# Altium schematic sheet MPU-6050.SchDoc
size A4; SheetNumber: 3; SheetTotal: 4
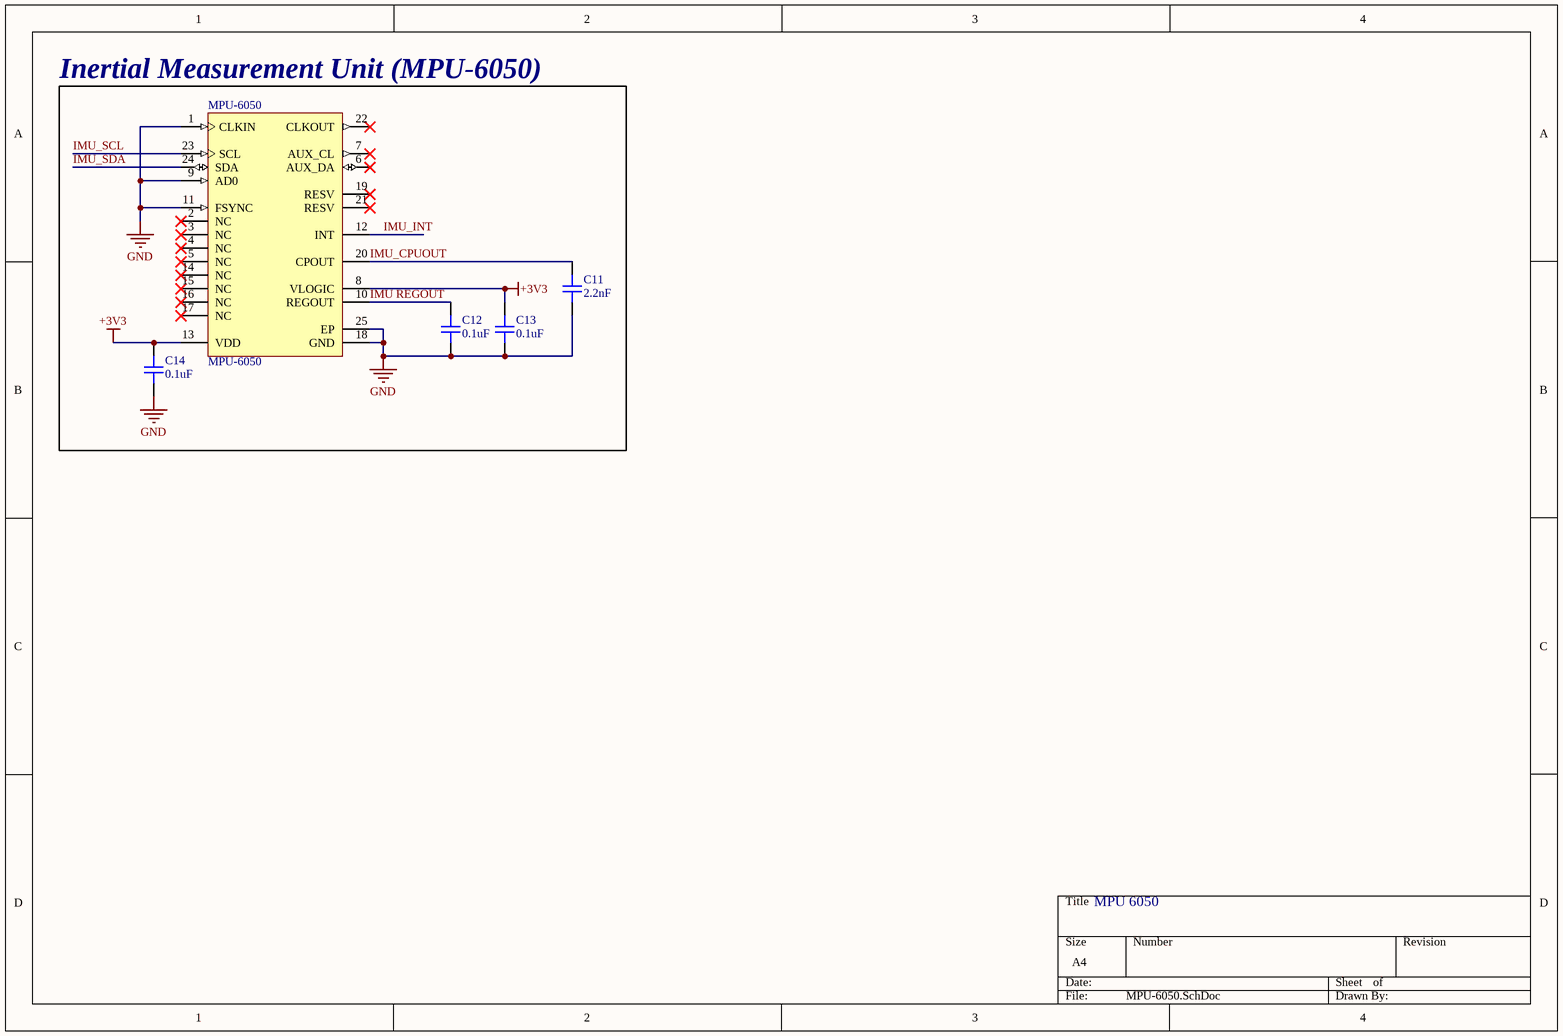
[diagram p0: MPU-6050.SchDoc]

## Parts
C11  2.2nF  [CAP_0402]
C12  0.1uF  [CAP_0402]
C13  0.1uF  [CAP_0402]
C14  0.1uF  [CAP_0402]
MPU-6050  MPU-6050  [IS-QFN-24_V]

## Blocks framed on the sheet
Inertial Measurement Unit (MPU-6050): C11-C14 MPU-6050

## Nets
+3V3: C13.2 C14.2 MPU-6050.8(VLOGIC) MPU-6050.13(VDD)
GND: C11.1 C12.1 C13.1 C14.1 MPU-6050.1(CLKIN) MPU-6050.9(AD0) MPU-6050.11(FSYNC) MPU-6050.18(GND) MPU-6050.25(EP)
IMU REGOUT: C12.2 MPU-6050.10(REGOUT)
IMU_CPUOUT: C11.2 MPU-6050.20(CPOUT)
IMU_INT: MPU-6050.12(INT)
IMU_SCL: MPU-6050.23(SCL)
IMU_SDA: MPU-6050.24(SDA)

Not connected (* = marked no-connect by the designer): MPU-6050 2(NC)* 3(NC)* 4(NC)* 5(NC)* 6(AUX_DA)* 7(AUX_CL)* 14(NC)* 15(NC)* 16(NC)* 17(NC)* 19(RESV)* 21(RESV)* 22(CLKOUT)*

## Notes on the sheet
- MPU 6050

## Library data of the parts
C11-C14 = CAP_0402: Capacitor SMD 0402; Manufacturer: *; Manufacturer Part Number: *; Distributor Link: *; LCSC: *; Rating: *; Dielectric: *
MPU-6050 = CMP-1753-00002-2: 3-Axis Gyroscope, Accelerometer and a Digital Motion Processor(TM) (DMP), 2.375 to 3.46 V, -40 to 85 degC, 24-Pin QFN, RoHS, Tape and Reel; Manufacturer: InvenSense; Featured Product: MPU-60506-Axis,IntegratedI²CSolution; Other Names: 1428-1007-2 / MPU6050; Sensor Type: MotionTracking; Online Catalog: MPU-6000™Series; Unit PriceUSD: Digital; Datasheet Version: Rev. 3.3, 05/2012; Category: Sensors,Transducers; Datasheet URL: http://datasheet.octopart.com/MPU-6050-InvenSense-datasheet-14421344.pdf; Family: Multifunction; Standard Package: 5,000; Manufacturer URL: http://www.invensense.com/; Output Type: Digital; Dynamic Catalog: MPU-6000™Series